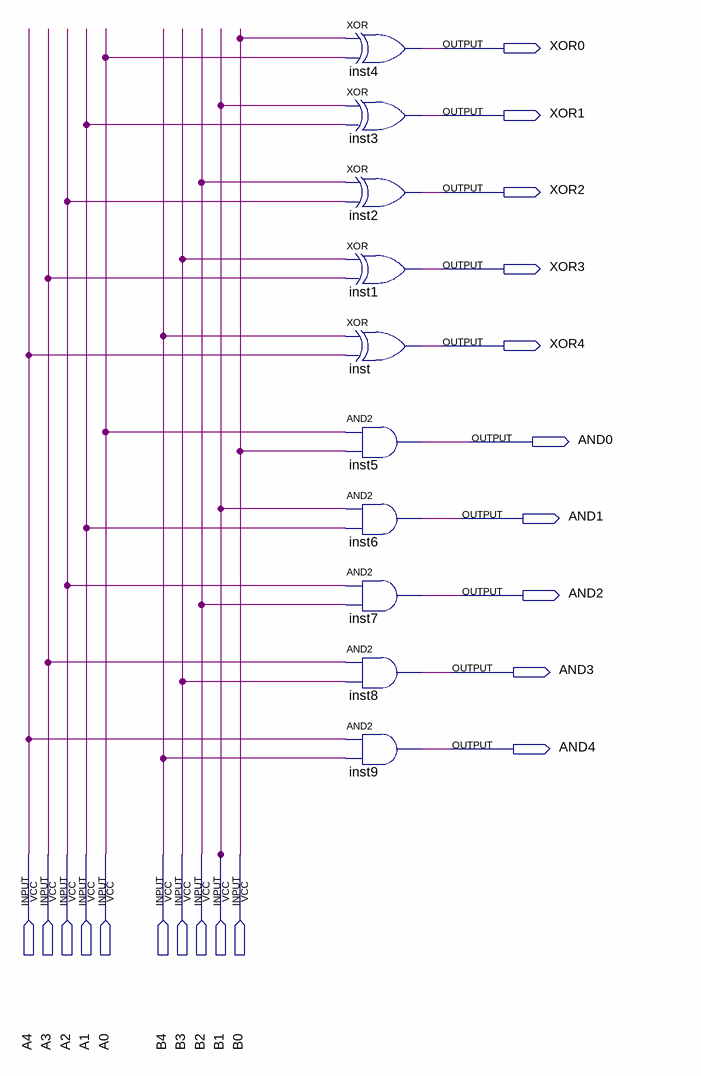
[diagram p0: schematic sheet]
// Quartus schematic bloco_logico.bdf as structural Verilog: 10 symbols, 20 pins
module bloco_logico (
  input  A4,
  input  A3,
  input  A2,
  input  A1,
  input  A0,
  input  B4,
  input  B3,
  input  B2,
  input  B1,
  input  B0,
  output XOR0,
  output XOR1,
  output XOR2,
  output XOR3,
  output XOR4,
  output AND0,
  output AND1,
  output AND2,
  output AND3,
  output AND4
);

  xor inst4 (XOR0, B0, A0);
  xor inst3 (XOR1, B1, A1);
  xor inst2 (XOR2, B2, A2);
  xor inst1 (XOR3, B3, A3);
  xor inst (XOR4, B4, A4);
  and inst5 (AND0, A0, B0);
  and inst6 (AND1, B1, A1);
  and inst7 (AND2, A2, B2);
  and inst8 (AND3, A3, B3);
  and inst9 (AND4, A4, B4);
endmodule
